# Altium project Zasilanie.PrjPcb
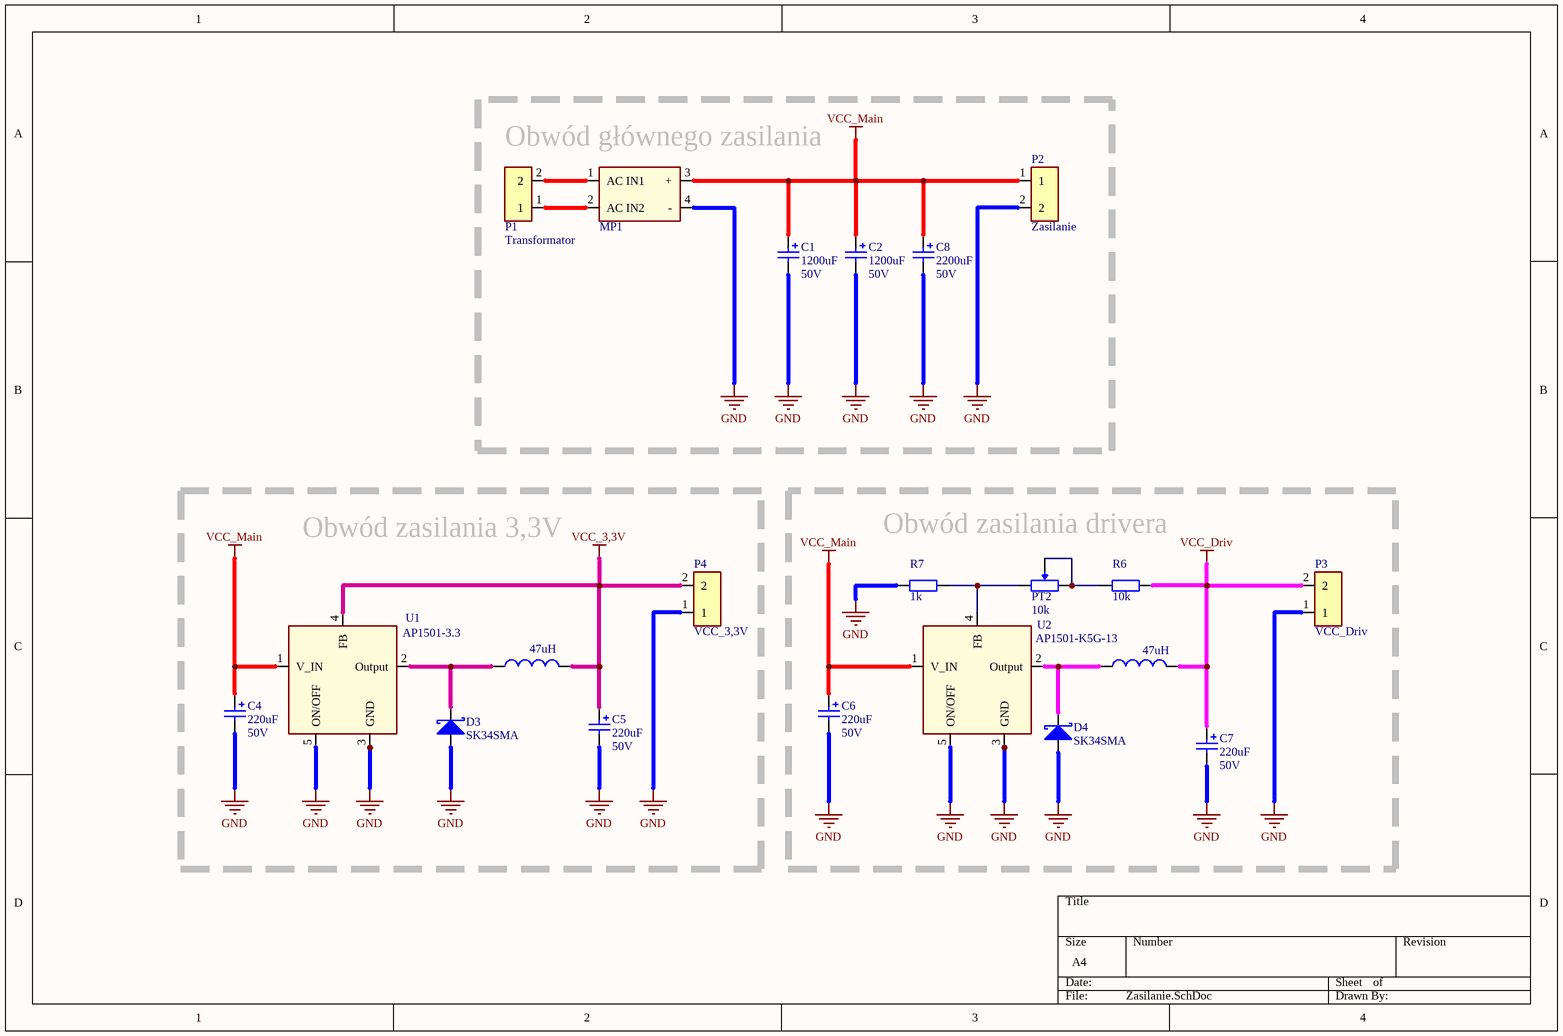
[diagram p0: Zasilanie.SchDoc]
1 sheet, 21 parts. Net scope: global (net labels, ports and power ports of the same name join across sheets).
Board file: Zasilanie.PcbDoc

## Sheet Zasilanie.SchDoc
size A4; SheetNumber: 1; SheetTotal: 1

### Parts
C1  Parametr_1: 1200uF  Parametr_2: 50V  [C_POL_D16x25]  (hidden comment: Kondesator elektrolityczny)
C2  Parametr_1: 1200uF  Parametr_2: 50V  [C_POL_D16x25]  (hidden comment: Kondesator elektrolityczny)
C4  Parametr_1: 220uF  Parametr_2: 50V  [C_POL_D10x16]  (hidden comment: Kondesator elektrolityczny)
C5  Parametr_1: 220uF  Parametr_2: 50V  [C_POL_D10x16]  (hidden comment: Kondesator elektrolityczny)
C6  Parametr_1: 220uF  Parametr_2: 50V  [C_POL_D10x16]  (hidden comment: Kondesator elektrolityczny)
C7  Parametr_1: 220uF  Parametr_2: 50V  [C_POL_D10x16]  (hidden comment: Kondesator elektrolityczny)
C8  Parametr_1: 2200uF  Parametr_2: 50V  [C_POL-D25X50]  (hidden comment: Kondesator elektrolityczny)
D3  SK34SMA  [DO-214AC]
D4  SK34SMA  [DO-214AC]
L2  Parametr_1: 47uH  [DE1207]
L3  Parametr_1: 47uH  [DE1207]
MP1  KBPC5010W  [KBPC5010W]  (value not drawn)
P1  Oznaczenie: Transformator  [ARK2-5mm]  (hidden comment: TRAFO)
P2  Oznaczenie: Zasilanie  [ARK2-5mm]  (hidden comment: VCC_MAIN)
P3  VCC_DRIV  [ARK2-5mm]
P4  VCC_3,3V  [ARK2-5mm]
PT2  Parametr_1: 10k  [Potecjomert]  (hidden comment: Potentiometer)
R6  Parametr_1: 10k  [SMD-1206-RES]  (hidden comment: Rezystor)
R7  Parametr_1: 1k  [SMD-1206-RES]  (hidden comment: Rezystor)
U1  Oznaczenie: AP1501-3.3  [TO263-5L]  (hidden comment: AP1501)
U2  Oznaczenie: AP1501-K5G-13  [TO263-5L]  (hidden comment: AP1501)

### Blocks framed on the sheet
Obwód głównego zasilania: C1 C2 C8 MP1 P1 P2
Obwód zasilania 3,3V: C4 C5 D3 L2 P4 U1
Obwód zasilania drivera: C6 C7 D4 L3 P3 PT2 R6 R7 U2

### Nets
GND: C1.1 C2.1 C4.1 C5.1 C6.1 C7.1 C8.1 D3.2(A) D4.2(A) MP1.4(-) P2.2 P3.1 P4.1 R7.2 U1.3(GND) U1.5(ON/OFF) U1.6 U2.3(GND) U2.5(ON/OFF) U2.6
VCC_3,3V: C5.2 L2.2 P4.2 U1.4(FB)
VCC_Driv: C7.2 L3.2 P3.2 R6.1
VCC_Main: C1.2 C2.2 C4.2 C6.2 C8.2 MP1.3(+) P2.1 U1.1(V_IN) U2.1(V_IN)
NetD3_1: D3.1(K) L2.1 U1.2(Output)
NetD4_1: D4.1(K) L3.1 U2.2(Output)
NetMP1_1: MP1.1(AC_IN1) P1.2
NetMP1_2: MP1.2(AC_IN2) P1.1
NetPT2_1: PT2.1(TOP) PT2.2(TAP) R6.2
NetPT2_3: PT2.3(BOT) R7.1 U2.4(FB)

### Library data of the parts
C1 C2 = Kondesator elektrolityczny: Dostawca: TME; Montaż: THT; Obudowa: D16x25; Parametr_3: Tolerancja:; Parametr_4: Czas życzia:; Parametr_5: Temperatura pracy:; Nazwa: Kondesator elektrolityczny; Kod TME: UHW1H122MHD
C4-C7 = Kondesator elektrolityczny: Dostawca: TME; Montaż: THT; Obudowa: D10x16; Parametr_3: Tolerancja:; Parametr_4: Czas życzia:; Parametr_5: Temperatura pracy:; Nazwa: Kondesator elektrolityczny
  C4 C6: Kod TME: PF1H221MNN1016
  C5: Kod TME: CE-220/16PHT-Y
  C7: Kod TME: JRG-220U/25
C8 = Kondesator elektrolityczny: Dostawca: TME; Parametr_3: Tolerancja:; Parametr_4: Czas życzia:; Parametr_5: Temperatura pracy:; Nazwa: Kondesator elektrolityczny
D3 D4 = SK34SMA: Dioda Schottky; Dostawca: TME; Montaż: THT; Parametr_1: Prąd: 3A; Parametr_2: Max prąd imp.: 80A; Parametr_3: Max nap. wsteczne: 40V; Producent: DIOTEC SEMICONDUCTOR; Nazwa: Dioda Schottky; Obudowa: DO-214AC; Oznaczenie: SK34SMA; Kod TME: SK34SMA-3G-DIO
L2 = Cewka: Dostawca: TME; Montaż: SMD; Nazwa: Dławik mocy; Oznaczenie: 3; Parametr_2: Prąd: 2,8; Parametr_4: Toleracja: 20%; Parametr_3: Rezystancja: 120mOhm; Parametr_5: Temperatura:; Producent: FERROCORE; Obudowa: DE1207; Kod TME: DE1207-68
L3 = Cewka: Dostawca: TME; Montaż: SMD; Nazwa: Dławik mocy; Oznaczenie: DE1207-68; Parametr_2: Prąd: 2,8; Parametr_4: Toleracja: 20%; Parametr_3: Rezystancja: 120mOhm; Parametr_5: Temperatura:; Producent: FERROCORE; Obudowa: DE1207; Kod TME: DE1207-68
MP1 = KBPC5010W: Mostek porstowniczy; Montaż: THT; Obudowa: MB-25W; Nazwa: Mostek prostowniczy; Parametr_1: Prad: 50A; Parametr_2: Max Prad w impulsie: 500A; Parametr_3: Max Nap przewodzenia: 1,1V; Parametr_4: Max Nap wsteczne: 1kV; Parametr_5: Jednofazowy; Producent: DC COMPONENTS; Oznaczenie: KBPC5010W; Kod TME: KBPC5010W
P1-P4 = Złacze śrubowe: Dostawca: TME; Montaż: THT; Nazwa: Listwa zaciskowa do druku, XY301V-2P; Parametr_1: 250VDC/AC; Parametr_2: 24A; Parametr_3: 2,5mm2; Producent: DEGSON ELECTRONICS; Kod TME: DG300-5.0-2P12
  P3: Oznaczenie: VCC_Driv
  P4: Oznaczenie: VCC_3,3V
PT2 = Potentiometer: Potentiometer montażowy wielobortowy; Parametr_2: Moc:; Parametr_3: Tolerancja:; Parametr_4: Charakterystyka:; Parametr_5: Temperatura pracy:; Parametr_6: Max nap. pracy:; Nazwa: Potentiometer montażowy wielobortowy
R6 R7 = Rezystor: Parametr_2: Moc: 0,25W; Parametr_3: Tolerancja: 1%; Parametr_4: Max nap. pracy:; Parametr_5: Max nap impulsowe:; Nazwa: Rezystor
U1 = AP1501: przetwornica DC/DC buck; Dostawca: TME; Parametr_1: Nap. wy: 3.3V; Parametr_2: Prąd: 3A; Parametr_3: Częstotliwość: 150kHz; Parametr_4: Temperatura: -20-85C; Parametr_5: Sprawność: 73%; Producent: DIODES INCORPORATED; Nazwa: przetwornica DC/DC buck; Kod TME: AP1501-33K5G-13
U2 = AP1501: przetwornica DC/DC buck; Dostawca: TME; Parametr_1: Nap. wy: 1,23-37VV; Parametr_2: Prąd: 3A; Parametr_3: Częstotliwość: 150kHz; Parametr_4: Temperatura: -20-85C; Parametr_5: Sprawność: 73%; Producent: DIODES INCORPORATED; Nazwa: przetwornica DC/DC buck; Kod TME: AP1501-K5G-13